# Altium schematic sheet Power_Supply.SchDoc
size A; SheetNumber: 1; SheetTotal: 3
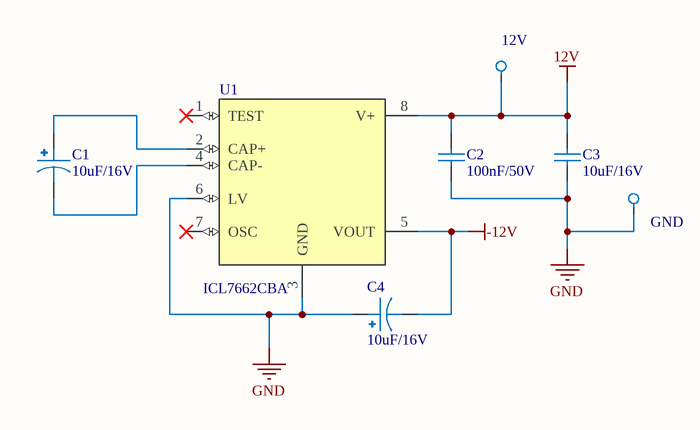
[diagram p0: Power_Supply.SchDoc]

## Parts
12V  Testpoint_SMD  [TestPoint_Pad_3.0x3.0mm]  (value not drawn)
C1  10uF/16V  [TanTa_Cap_A]
C2  100nF/50V  [CAP_0603]
C3  10uF/16V  [CAP_0603]
C4  10uF/16V  [TanTa_Cap_A]
GND  Testpoint_SMD  [TestPoint_Pad_3.0x3.0mm]  (value not drawn)
U1  ICL7662CBA  [SOIC-8]

## Nets
12V: 12V.1 C2.2 C3.2 U1.8(V+)
-12V: C4.2 U1.5(VOUT)
GND: C2.1 C3.1 C4.1 GND.1 U1.3(GND) U1.6(LV)
NetC1_1: C1.1 U1.2(CAP+)
NetC1_2: C1.2 U1.4(CAP-)

Not connected (* = marked no-connect by the designer): U1 1(TEST)* 7(OSC)*

## Library data of the parts
C1 C4 = Tanta_Cap_10uF_16V_1206: Tantalum Capacitors 10uF 16V 1206; Supply Part Number: AVX; Supply Name: 1206 AVX
C2 = Ceramic_Cap_100nF_50V_0603: CAP, size 0603, 100nF, 50V; Supply Part Number: Tụ Gốm 0603 100nF (0.1uF) 50V; Supply Name: Thegioiic; Datasheet: *; Supply URL: https://www.thegioiic.com/tu-gom-0603-100nf-0-1uf-50v
C3 = Ceramic_Cap_10uF_16V_0603: CAP, size 0603, 10uF, 16V; Supply Part Number: Tụ Gốm 0603 10uF 16V; Supply Name: Thegioiic; Datasheet: *; Supply URL: https://www.thegioiic.com/tu-gom-0603-10uf-16v
U1 = ICL7662CBA: Vin: 4.5V ~ 20V, Vout: -Vin, 8-SOIC; Supply Part Number: IC Dán ICL7662; Supply Name: Chipn24; Datasheet: https://www.analog.com/media/en/technical-documentation/data-sheets/icl7662-si7661.pdf; Supply URL: https://chipn24.com/sop-ic-dan-icl7662-sop-8-smd-icl7662cba-id9015.html
12V GND = Testpoint_SMD: Datasheet: *; Supply Name: *; Supply Part Number: *; Supply URL: *